# EasyEDA Pro project Custom Keyboard.epro, board PCB
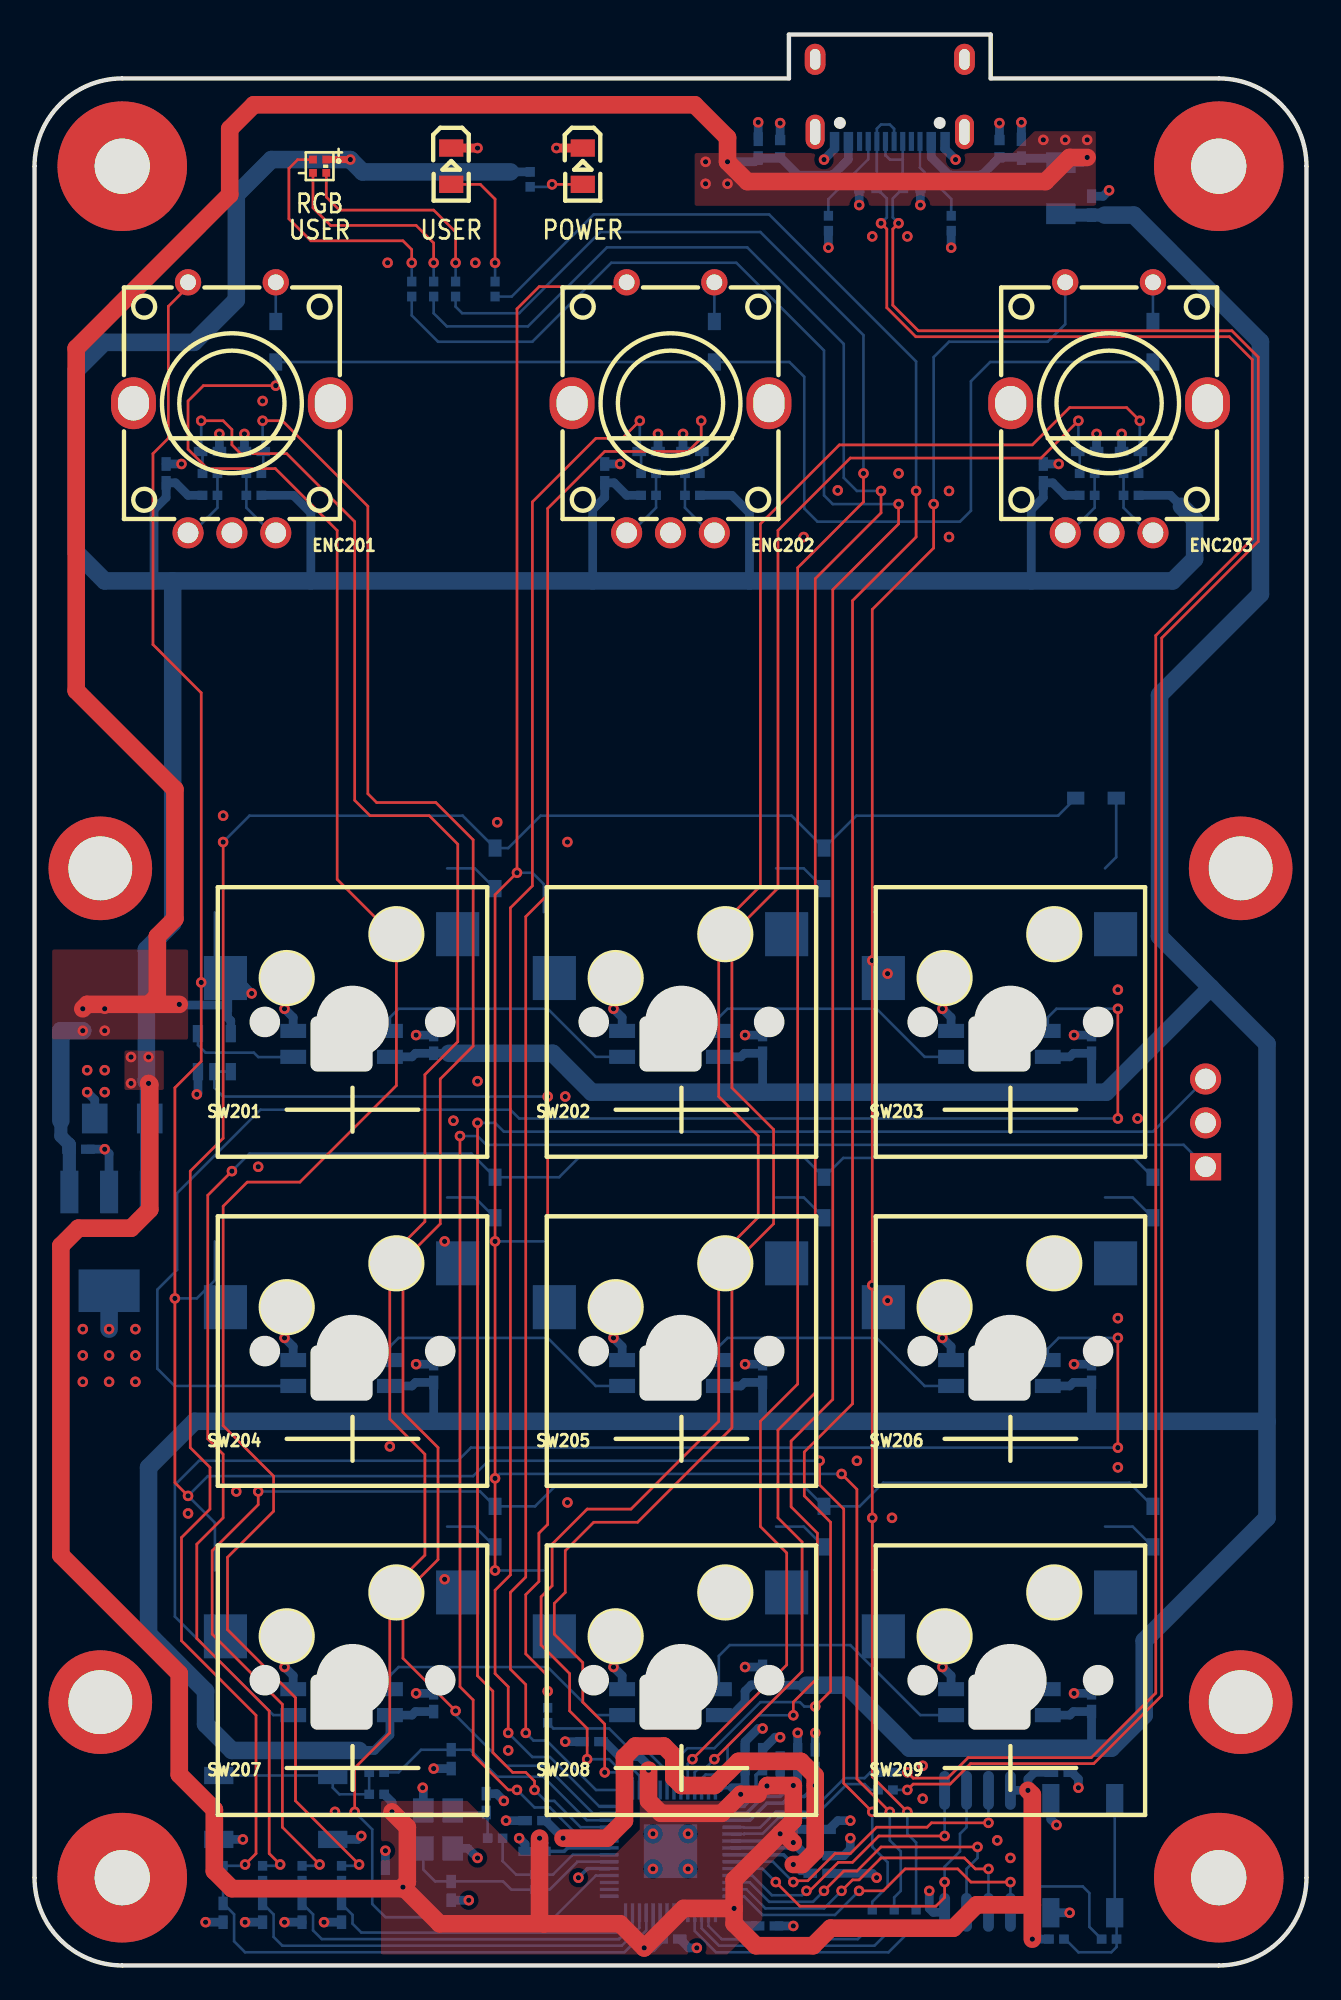
[diagram p2: board, top side]
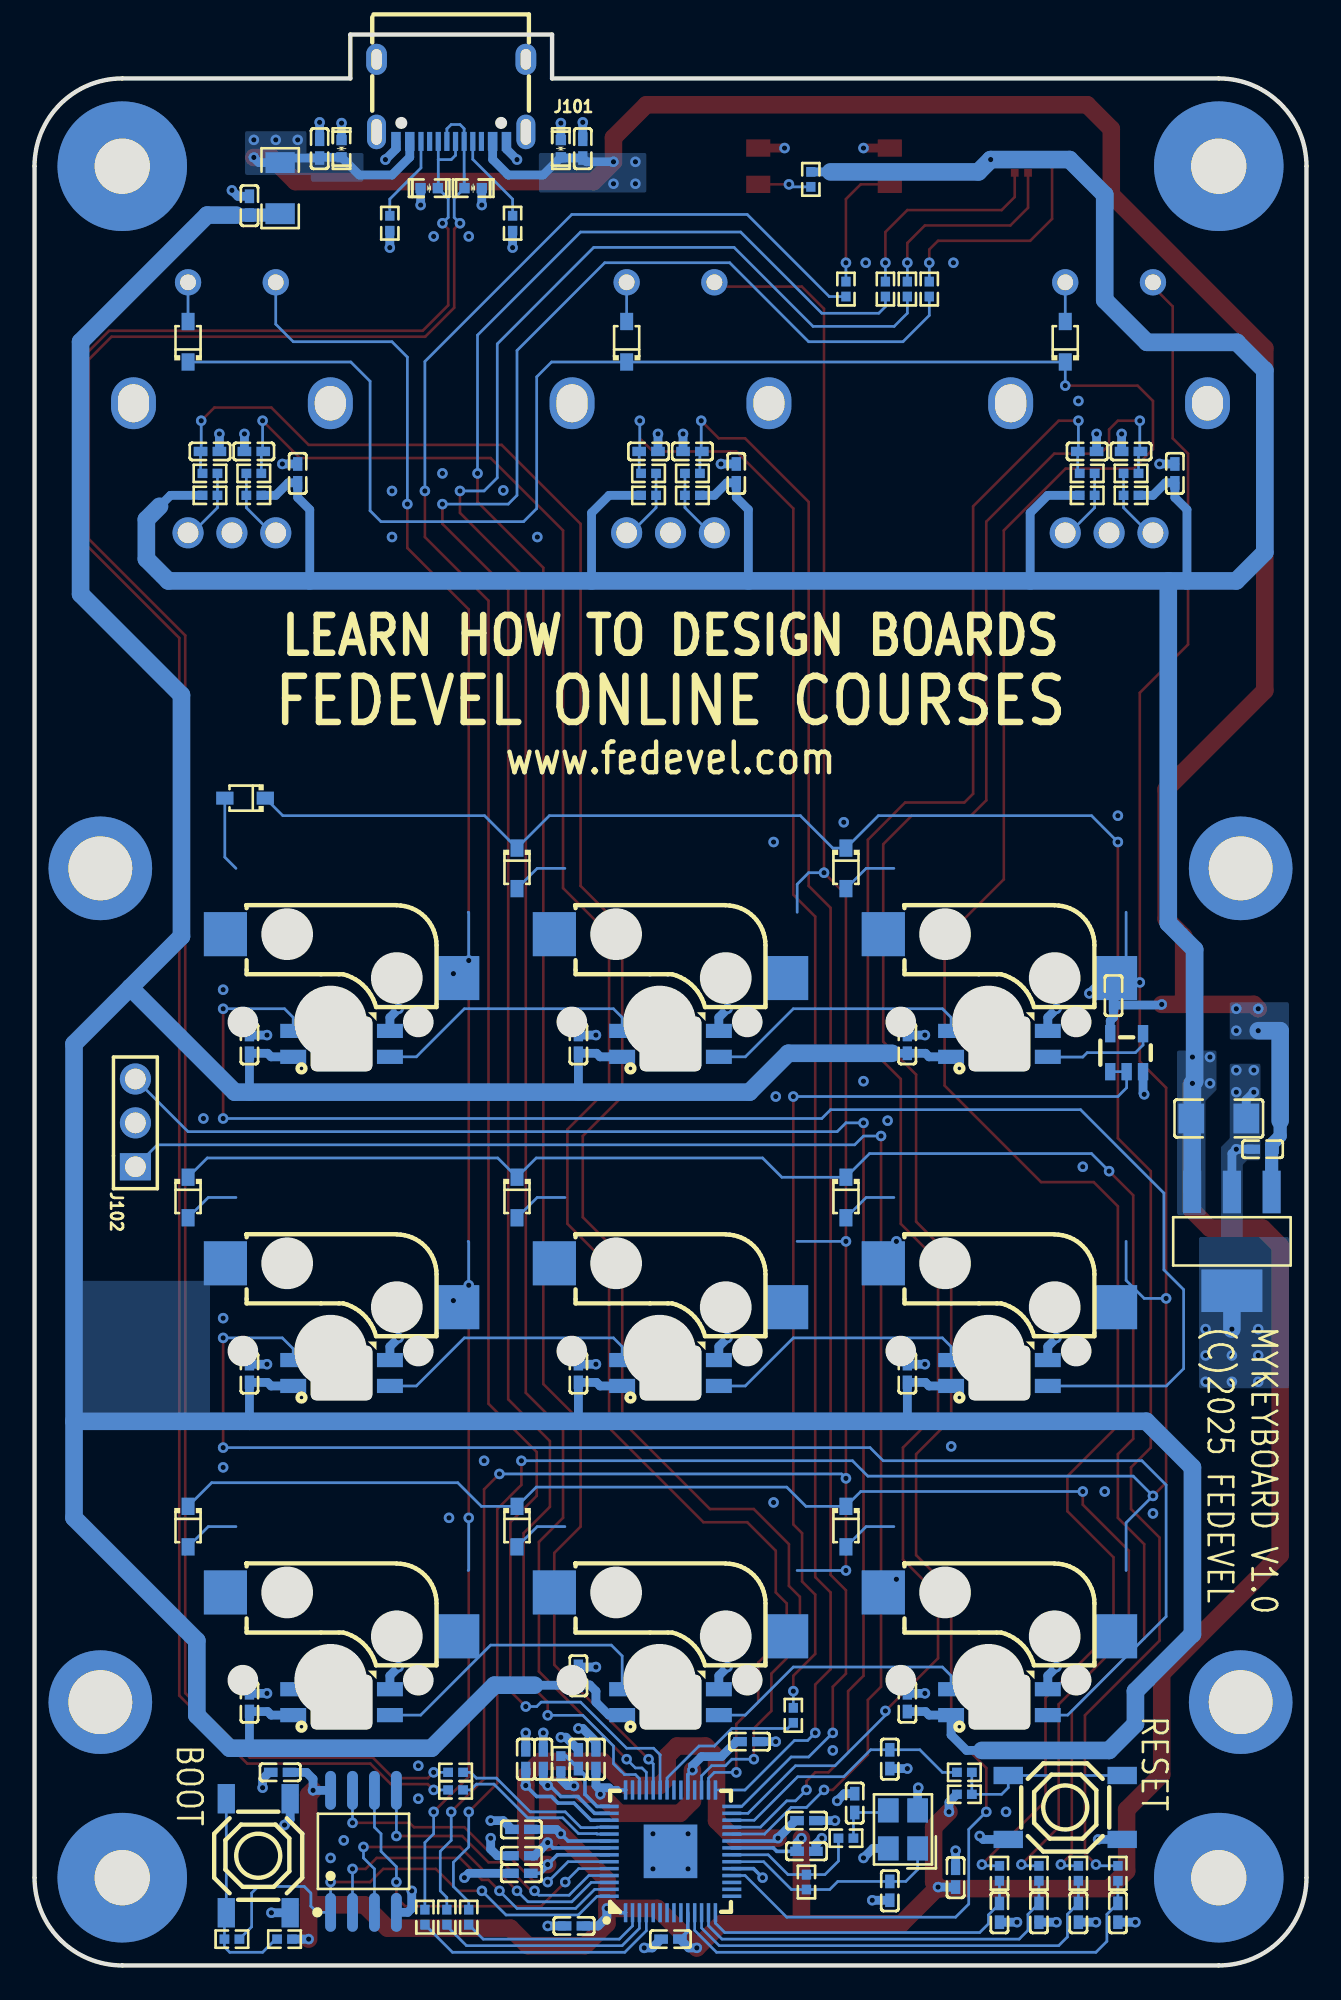
[diagram p3: board, bottom side, seen from below]

Outline 73.66 x 111.76 mm; copper layers: Top Layer, Inner1, Inner2, Bottom Layer. Coordinates in mm from the lower left corner of the outline.
Outline path: 0,104.14 0,5.08 arc(1.49,1.49) 5.08,0 68.58,0 arc(72.17,1.49) 73.66,5.08 73.66,104.14 arc(72.17,107.73) 68.58,109.22 55.37,109.22 55.37,111.76 43.69,111.76 43.69,109.22 5.08,109.22 arc(1.49,107.73) 0,104.14
Stack: Top Layer 0.035mm Outer layer copper thickness 1oz / Dielectric1 0.2104mm 7628 RC49% 8.6mil / Inner1 0.0152mm Inner layer copper thickness / Dielectric2 1.065mm 1.1mm H/HOZ Copper / Inner2 0.0152mm Inner layer copper thickness / Dielectric3 0.2104mm 7628 RC49% 8.6mil / Bottom Layer 0.035mm Outer layer copper thickness 1oz

## Design rules (mm)
net CON_USB_N: USB_CON
net CON_USB_P: USB_CON
net USB_N: USB
net USB_P: USB
template: User Custom Config
spacing copperThickness1oz (default): track to track 0.178, other pairs 0.076 to 0.305
spacing copperThickness2oz: track to track 0.203, other pairs 0.152 to 0.3
spacing copperThicknessInner0.5oz: track to track 0.089, other pairs 0.152 to 0.3
track width copperThickness1oz (default): min 0.152, default 0.203, max 2.54
track width copperThickness2oz: min 0.203, default 0.254, max 2.54
track width copperThickness0.5oz: min 0.089, default 0.254, max 2.54
differential pair differentialPair (default): width min 0.155, default 0.155, max 0.203; gap min 0.178, default 0.191
via viaSize (default): diameter min 0.61, default 0.61, max 10; hole min 0.305, default 0.305, max 6.299

## Placement (name value [footprint] x y rotation side)
C101  2.2uF  [C0402]  20.32 5.08 270 bottom
C102  100nF  [C0402]  45.47 7.87 180 bottom
C103  100nF  [C0402]  45.47 6.35 180 bottom
C104  100nF  [C0402]  41.15 11.94 270 bottom
C105  2.2uF  [C0402]  42.16 11.94 270 bottom
C106  2.2uF  [C0402]  44.2 11.94 270 bottom
C107  2.2uF  [C0402]  45.21 11.94 270 bottom
C108  100nF  [C0402]  45.47 5.33 180 bottom
C109  100nF  [C0402]  28.96 8.38 0 bottom
C110  1uF  [C0402]  61.21 101.85 270 bottom
C111  1uF  [C0402]  2.54 47.24 180 bottom
C112  47uF  [C1206]  5.08 49.02 0 bottom
C113  100nF  [C0402]  32.26 12.95 0 bottom
C114  100nF  [C0402]  28.96 6.6 0 bottom
C115  100nF  [C0402]  36.83 1.52 180 bottom
C116  100nF  [C0402]  42.42 2.29 180 bottom
C117  100nF  [C0402]  10.92 3.05 90 bottom
C118  1uF  [C0402]  41.91 105.16 270 bottom
C119  1uF  [C0402]  57.15 105.16 270 bottom
C120  100nF  [C0402]  13.21 3.05 90 bottom
C121  100nF  [C0402]  15.49 3.05 90 bottom
C122  100nF  [C0402]  17.78 3.05 90 bottom
C123  15pF  [C0402]  24.13 4.32 270 bottom
C124  15pF  [C0402]  26.16 9.4 90 bottom
C125  100nF  [C0402]  11.18 56.13 270 bottom
C126  100nF  [C0402]  59.44 11.18 180 bottom
C127  100nF  [C0402]  24.13 11.94 90 bottom
C201  2.2uF  [C0402]  7.62 86.36 270 bottom
C202  2.2uF  [C0402]  33.02 86.36 270 bottom
C203  10nF  [C0402]  10.16 87.63 180 bottom
C204  10nF  [C0402]  12.7 87.63 0 bottom
C205  10nF  [C0402]  35.56 87.63 180 bottom
C206  10nF  [C0402]  38.1 87.63 0 bottom
C207  2.2uF  [C0402]  58.42 86.36 270 bottom
C208  10nF  [C0402]  60.96 87.63 180 bottom
C209  10nF  [C0402]  63.5 87.63 0 bottom
C210  100nF  [C0402]  23.11 53.34 270 bottom
C211  100nF  [C0402]  42.16 53.34 270 bottom
C212  100nF  [C0402]  61.21 53.34 270 bottom
C213  100nF  [C0402]  23.11 34.29 270 bottom
C214  100nF  [C0402]  42.16 34.29 270 bottom
C215  100nF  [C0402]  61.21 34.29 270 bottom
C216  100nF  [C0402]  23.11 15.24 270 bottom
C217  100nF  [C0402]  42.16 16.76 270 bottom
C218  100nF  [C0402]  61.21 15.24 270 bottom
D101  GG0402052R542P  [D0402-BI]  43.18 105.16 270 bottom
D102  GG0402052R542P  [D0402-BI]  55.88 105.16 270 bottom
D103  GG0402052R542P  [D0402-BI]  48.26 102.87 0 bottom
D104  GG0402052R542P  [D0402-BI]  50.8 102.87 180 bottom
D201  1N5819WS  [SOD-323_L1.8-W1.3-LS2.5-RD]  26.67 63.5 270 bottom
D202  1N5819WS  [SOD-323_L1.8-W1.3-LS2.5-RD]  45.72 63.5 270 bottom
D203  1N5819WS  [SOD-323_L1.8-W1.3-LS2.5-RD]  61.47 67.56 0 bottom
D204  1N5819WS  [SOD-323_L1.8-W1.3-LS2.5-RD]  26.67 44.45 270 bottom
D205  1N5819WS  [SOD-323_L1.8-W1.3-LS2.5-RD]  45.72 44.45 270 bottom
D206  1N5819WS  [SOD-323_L1.8-W1.3-LS2.5-RD]  64.77 44.45 270 bottom
D207  1N5819WS  [SOD-323_L1.8-W1.3-LS2.5-RD]  26.67 25.4 270 bottom
D208  1N5819WS  [SOD-323_L1.8-W1.3-LS2.5-RD]  45.72 25.4 270 bottom
D209  1N5819WS  [SOD-323_L1.8-W1.3-LS2.5-RD]  64.77 25.4 270 bottom
D210  1N5819WS  [SOD-323_L1.8-W1.3-LS2.5-RD]  13.97 93.98 90 bottom
D211  1N5819WS  [SOD-323_L1.8-W1.3-LS2.5-RD]  39.37 93.98 90 bottom
D212  1N5819WS  [SOD-323_L1.8-W1.3-LS2.5-RD]  64.77 93.98 90 bottom
ENC201  PEC12R-4120F-S0012  [SW-TH_PEC12R-4120F-S0012_1]  11.43 90.17 0 top
ENC202  PEC12R-4120F-S0012  [SW-TH_PEC12R-4120F-S0012_1]  36.83 90.17 0 top
ENC203  PEC12R-4120F-S0012  [SW-TH_PEC12R-4120F-S0012_1]  62.23 90.17 0 top
J101  TYPE-C 16PIN 2MD(073)  [USB-C-SMD_TYPE-C-6PIN-2MD-073]  49.53 107.95 0 bottom
J102  2.54-1*3P针  [HDR-TH_3P-P2.54-V-M-1]  67.82 48.77 90 bottom
J201  CPG151101S11-16  [SMD_KEYBOARD-SW_1]  17.78 58.42 0 bottom
J202  CPG151101S11-16  [SMD_KEYBOARD-SW_1]  36.83 58.42 0 bottom
J203  CPG151101S11-16  [SMD_KEYBOARD-SW_1]  55.88 58.42 0 bottom
J204  CPG151101S11-16  [SMD_KEYBOARD-SW_1]  17.78 39.37 0 bottom
J205  CPG151101S11-16  [SMD_KEYBOARD-SW_1]  36.83 39.37 0 bottom
J206  CPG151101S11-16  [SMD_KEYBOARD-SW_1]  55.88 39.37 0 bottom
J207  CPG151101S11-16  [SMD_KEYBOARD-SW_1]  17.78 20.32 0 bottom
J208  CPG151101S11-16  [SMD_KEYBOARD-SW_1]  36.83 20.32 0 bottom
J209  CPG151101S11-16  [SMD_KEYBOARD-SW_1]  55.88 20.32 0 bottom
LED101  NH-B1010RGBT-HF  [LED-ARRAY-SMD_4P-L1.0-W1.0-TR_NH-B1010RGBT_1]  16.51 104.14 0 top
LED102  KT-0805G  [LED0805-R-RD]  31.75 104.14 270 top
LED103  KT-0805Y  [LED0805-R-RD]  24.13 104.14 270 top
LED201  SK6812MINI-E  [LED-SMD_L3.2-W2.8-TR]  17.78 53.34 0 bottom
LED202  SK6812MINI-E  [LED-SMD_L3.2-W2.8-TR]  36.83 53.34 0 bottom
LED203  SK6812MINI-E  [LED-SMD_L3.2-W2.8-TR]  55.88 53.34 0 bottom
LED204  SK6812MINI-E  [LED-SMD_L3.2-W2.8-TR]  17.78 34.29 0 bottom
LED205  SK6812MINI-E  [LED-SMD_L3.2-W2.8-TR]  36.83 34.29 0 bottom
LED206  SK6812MINI-E  [LED-SMD_L3.2-W2.8-TR]  55.88 34.29 0 bottom
LED207  SK6812MINI-E  [LED-SMD_L3.2-W2.8-TR]  17.78 15.24 0 bottom
LED208  SK6812MINI-E  [LED-SMD_L3.2-W2.8-TR]  36.83 15.24 0 bottom
LED209  SK6812MINI-E  [LED-SMD_L3.2-W2.8-TR]  55.88 15.24 0 bottom
MH201  STANDOFF_M2.5x3.5MM  [STANDOFF_M2.5x3.5MM_RF_v1.0]  3.81 15.24 0 top
MH202  STANDOFF_M2.5x3.5MM  [STANDOFF_M2.5x3.5MM_RF_v1.0]  69.85 15.24 0 top
MH203  STANDOFF_M2.5x3.5MM  [STANDOFF_M2.5x3.5MM_RF_v1.0]  3.81 63.5 0 top
MH204  STANDOFF_M2.5x3.5MM  [STANDOFF_M2.5x3.5MM_RF_v1.0]  69.85 63.5 0 top
MH205  -  [MH_7.5X3.2MM_RF_v1.0]  5.08 5.08 0 top
MH206  -  [MH_7.5X3.2MM_RF_v1.0]  68.58 5.08 0 top
MH207  -  [MH_7.5X3.2MM_RF_v1.0]  5.08 104.14 0 top
MH208  -  [MH_7.5X3.2MM_RF_v1.0]  68.58 104.14 0 top
R101  200Ω  [R0402]  43.18 11.68 90 bottom
R102  100mΩ  [R1206]  59.44 102.87 270 bottom
R103  1kΩ  [R0402]  26.67 97.03 270 bottom
R104  1kΩ  [R0402]  28.7 103.38 90 bottom
R105  1kΩ  [R0402]  24.38 97.03 270 bottom
R106  1kΩ  [R0402]  23.11 97.03 270 bottom
R107  1kΩ  [R0402]  21.84 97.03 270 bottom
R108  27Ω  [R0402]  48.51 2.79 90 bottom
R109  27Ω  [R0402]  49.28 11.18 180 bottom
R110  27Ω  [R0402]  49.78 2.79 90 bottom
R111  27Ω  [R0402]  49.28 10.16 180 bottom
R112  27Ω  [R0402]  51.05 2.79 90 bottom
R113  0Ω  [R0402]  10.92 5.33 90 bottom
R114  0Ω  [R0402]  13.21 5.33 90 bottom
R115  0Ω  [R0402]  15.49 5.33 90 bottom
R116  0Ω  [R0402]  17.78 5.33 90 bottom
R117  27Ω  [R0402]  29.72 14.48 90 bottom
R118  5.1kΩ  [R0402]  53.09 100.84 90 bottom
R119  5.1kΩ  [R0402]  45.97 100.84 90 bottom
R120  1MΩ  [R0402]  28.96 4.83 270 bottom
R121  1kΩ  [R0402]  26.67 7.37 0 bottom
R122  100kΩ  [R0402]  59.18 1.52 180 bottom
R123  10kΩ  [R0402]  19.81 9.91 0 bottom
R124  1kΩ  [R0402]  62.23 1.52 180 bottom
R125  27Ω  [R0402]  19.81 11.18 0 bottom
R201  10kΩ  [R0402]  10.16 85.09 180 bottom
R202  10kΩ  [R0402]  12.7 85.09 0 bottom
R203  10kΩ  [R0402]  35.56 85.09 180 bottom
R204  10kΩ  [R0402]  38.1 85.09 0 bottom
R205  10kΩ  [R0402]  10.16 86.36 0 bottom
R206  10kΩ  [R0402]  35.56 86.36 0 bottom
R207  10kΩ  [R0402]  12.7 86.36 180 bottom
R208  10kΩ  [R0402]  38.1 86.36 180 bottom
R209  10kΩ  [R0402]  60.96 85.09 180 bottom
R210  10kΩ  [R0402]  63.5 85.09 0 bottom
R211  10kΩ  [R0402]  60.96 86.36 0 bottom
R212  10kΩ  [R0402]  63.5 86.36 180 bottom
SW101  TS-1187A-B-A-B  [SW-SMD_4P-L5.1-W5.1-P3.70-LS6.5-TL-2]  60.71 6.35 270 bottom
SW102  TS-1187A-B-A-B  [SW-SMD_4P-L5.1-W5.1-P3.70-LS6.5-TL-2]  13.97 9.14 0 bottom
SW201  CPG151101S21  [KEY-TH_CPG1511F01S0X_1]  17.78 58.42 0 top
SW202  CPG151101S21  [KEY-TH_CPG1511F01S0X_1]  36.83 58.42 0 top
SW203  CPG151101S21  [KEY-TH_CPG1511F01S0X_1]  55.88 58.42 0 top
SW204  CPG151101S21  [KEY-TH_CPG1511F01S0X_1]  17.78 39.37 0 top
SW205  CPG151101S21  [KEY-TH_CPG1511F01S0X_1]  36.83 39.37 0 top
SW206  CPG151101S21  [KEY-TH_CPG1511F01S0X_1]  55.88 39.37 0 top
SW207  CPG151101S21  [KEY-TH_CPG1511F01S0X_1]  17.78 20.32 0 top
SW208  CPG151101S21  [KEY-TH_CPG1511F01S0X_1]  36.83 20.32 0 top
SW209  CPG151101S21  [KEY-TH_CPG1511F01S0X_1]  55.88 20.32 0 top
U101  RP2040  [LQFN-56_L7.0-W7.0-P0.4-EP_1]  36.83 6.6 90 bottom
U102  LM3940IMP-3.3/NOPB  [SOT-223_L6.5-W3.5-P2.30-LS7.0-BR]  4.32 41.91 90 bottom
U103  SN74LV1T34DBVR  [SOT-23-5_L2.9-W1.6-P0.95-LS2.8-BR]  10.41 52.83 270 bottom
U104  W25Q128JVSIQ  [SOIC-8_L5.3-W5.3-P1.27-LS8.0-BL]  54.61 6.6 180 bottom
Y101  ABM8-272-T3  [CRYSTAL-SMD_4P-L3.2-W2.5-BL]  23.37 7.87 90 bottom

## Footprints (pads in the part's own frame, mm; a bottom-side part is the same pattern mirrored in y, then rotated)
C0402
  rect 0.79x0.54 smd: 1(-0.545,0) 2(0.545,0)
C1206
  rect 1.485x1.728 smd: 1(-1.593,0) 2(1.593,0)
CRYSTAL-SMD_4P-L3.2-W2.5-BL
  rect 1.4x1.2 smd: 1(-1.1,-0.85) 2(1.1,-0.85) 3(1.1,0.85) 4(-1.1,0.85)
D0402-BI
  rect 0.6x0.6 smd: 1(-0.5,0) 2(0.5,0)
HDR-TH_3P-P2.54-V-M-1
  rect 1.575x1.8 hole 1.2: 1(-2.54,0)
  round 1.8 hole 1.2: 2(0,0) 3(2.54,0)
LED0805-R-RD
  rect 1x1.399 smd: 1(1.05,0) 2(-1.05,0)
LED-ARRAY-SMD_4P-L1.0-W1.0-TR_NH-B1010RGBT_1
  rect 0.45x0.45 smd: 1(0.385,0.385) 2(0.385,-0.385) 3(-0.385,-0.385) 4(-0.385,0.385)
LED-SMD_L3.2-W2.8-TR
  rect 1.5x0.82 smd: 1(2.8,0.75) 2(2.8,-0.75) 3(-2.8,-0.75) 4(-2.8,0.75)
LQFN-56_L7.0-W7.0-P0.4-EP_1
  rect 1.1x0.2 smd: 1(-3.55,2.6) 2(-3.55,2.2) 3(-3.55,1.8) 4(-3.55,1.4) 5(-3.55,1) 6(-3.55,0.6) 7(-3.55,0.2) 8(-3.55,-0.2) 9(-3.55,-0.6) 10(-3.55,-1) 11(-3.55,-1.4) 12(-3.55,-1.8) 13(-3.55,-2.2) 14(-3.55,-2.6) 29(3.55,-2.6) 30(3.55,-2.2) 31(3.55,-1.8) 32(3.55,-1.4) 33(3.55,-1) 34(3.55,-0.6) 35(3.55,-0.2) 36(3.55,0.2) 37(3.55,0.6) 38(3.55,1) 39(3.55,1.4) 40(3.55,1.8) 41(3.55,2.2) 42(3.55,2.6)
  rect 0.2x1.1 smd: 15(-2.6,-3.55) 16(-2.2,-3.55) 17(-1.8,-3.55) 18(-1.4,-3.55) 19(-1,-3.55) 20(-0.6,-3.55) 21(-0.2,-3.55) 22(0.2,-3.55) 23(0.6,-3.55) 24(1,-3.55) 25(1.4,-3.55) 26(1.8,-3.55) 27(2.2,-3.55) 28(2.6,-3.55) 43(2.6,3.55) 44(2.2,3.55) 45(1.8,3.55) 46(1.4,3.55) 47(1,3.55) 48(0.6,3.55) 49(0.2,3.55) 50(-0.2,3.55) 51(-0.6,3.55) 52(-1,3.55) 53(-1.4,3.55) 54(-1.8,3.55) 55(-2.2,3.55) 56(-2.6,3.55)
  rect 3.1x3.1 smd: 57(0,0)
MH_7.5X3.2MM_RF_v1.0
  round 7.5 hole 3.2: 1(0,0)
R0402
  rect 0.566x0.54 smd: 1(-0.433,0) 2(0.433,0)
R1206
  rect 1.208x1.701 smd: 1(-1.479,0) 2(1.479,0)
SMD_KEYBOARD-SW_1
  rect 2.5x2.55 smd: 1(-6.725,1.27) 2(6.725,-1.27)
SOD-323_L1.8-W1.3-LS2.5-RD
  rect 1x0.75 smd: 1(-1.173,0) 2(1.173,0)
SOIC-8_L5.3-W5.3-P1.27-LS8.0-BL
  oval 0.63x2.25 smd: 1(-1.905,-3.53) 2(-0.635,-3.53) 3(0.635,-3.53) 4(1.905,-3.53) 5(1.905,3.53) 6(0.635,3.53) 7(-0.635,3.53) 8(-1.905,3.53)
SOT-23-5_L2.9-W1.6-P0.95-LS2.8-BR
  rect 1x0.6 smd: 1(1.1,-0.95) 2(1.1,0) 3(1.1,0.95) 4(-1.1,0.95) 5(-1.1,-0.95)
SOT-223_L6.5-W3.5-P2.30-LS7.0-BR
  rect 2.465x1.05 smd: 1(2.857,-2.3) 2(2.857,0) 3(2.857,2.3)
  rect 2.465x3.54 smd: 4(-2.857,0)
STANDOFF_M2.5x3.5MM_RF_v1.0
  round 6 hole 3.7: 1(0,0)
SW-SMD_4P-L5.1-W5.1-P3.70-LS6.5-TL-2
  rect 1.7x1 smd: 1(-3.3,1.85) 2(3.3,1.85) 3(-3.3,-1.85) 4(3.3,-1.85)
SW-TH_PEC12R-4120F-S0012_1
  round 1.524 hole 0.914: 1(-2.54,7.25) 2(2.54,7.25)
  oval 2.6x3 hole 1.8x2.2: 3(5.7,0.25)
  oval 2.6x3 hole 1.8x2: 4(-5.7,0.25)
  round 1.8 hole 1.2: A(-2.54,-7.25) B(2.54,-7.25) C(0,-7.25)
USB-C-SMD_TYPE-C-6PIN-2MD-073
  rect 0.55x1.1 smd: 1(-3.2,2.375) 2(-2.4,2.375) 11(2.4,2.375) 12(3.2,2.375)
  rect 0.3x1.1 smd: 3(-1.75,2.375) 4(-1.25,2.375) 5(-0.75,2.375) 6(-0.25,2.375) 7(0.25,2.375) 8(0.75,2.375) 9(1.25,2.375) 10(1.75,2.375)
  oval 1.2x1.8 hole 0.6x1.2: 13(-4.325,-2.375) 14(4.325,-2.375)
  oval 1.1x2 hole 0.6x1.5: 13(-4.325,1.825) 14(4.325,1.825)

## Nets
As in the schematic.

Pads without a net: J101 3 9; LED209 2; U101 5 6 7 8 9 15 16 17 32 34 35 41

## Via types
v1: diameter 0.61, hole 0.305, Top Layer to Bottom Layer, 235 vias

## Routing (per net, layer and track width the routed paths; a pad name or vN(x,y) marks a point on that pad's centre or on a via; arc(x,y) is an arc through that point)
+1V1: length 43.5
  Top Layer w1.016: v1(43.94,5.84) 44.45,5.84 45.21,6.6 v1(45.21,10.41) 45.21,10.98 44.38,11.81 40.77,11.81 39.37,10.41 37.47,10.41 37.02,10.86 37.02,12.13 36.45,12.7 34.8,12.7 34.16,12.06 34.16,8.38 33.15,7.37 v1(30.61,7.37)
  Bottom Layer w0.205: U101.45 41.42,8.4 42.42,9.4 43.34,9.4 43.72,9.78 44.58,9.78 v1(45.21,10.41) ; U101.23 30.77,7.2 v1(30.61,7.37) ; 44.92,5.33 44.32,5.33 43.94,5.72 v1(43.94,5.84) 43.38,6.4 U101.50
  Bottom Layer w0.508: v1(30.61,7.37) 29.59,8.38 C109.2 ; C107.2 v1(45.21,10.41)
+3V3: length 381.1
  Top Layer w0.406: LED101.1 v1(18.29,104.53)
  Top Layer w1.016: 29.5,2.41 23.46,2.41 v1(21.34,4.53) ; 29.5,2.41 29.25,2.67 v1(29.25,7.37) ; 29.5,2.41 33.91,2.41 v1(35.31,1.02) 37.59,3.3 v1(40.51,3.3) ; 57.78,3.51 57.78,9.88 v1(57.53,10.13) ; 57.78,3.51 v1(57.78,1.52) ; 57.78,3.51 54.56,3.51 53.21,2.16 46.1,2.16 45.09,1.14 41.78,1.14 40.51,2.41 v1(40.51,3.3) ; v1(40.51,3.3) 40.51,4.95 v1(43.18,7.62) ; v1(43.94,7.11) 43.43,7.62 v1(43.18,7.62) ; v1(20.7,8.89) 21.59,8 21.59,4.83 21.21,4.44 11.43,4.44 10.41,5.46 10.41,9.02 8.38,11.05 8.38,16.89 1.52,23.75 1.52,41.66 2.54,42.67 5.59,42.67 6.67,43.76 6.67,50.99 v1(6.6,51.05) ; 41.91,9.91 v1(40.89,9.91) 39.79,8.81 36.28,8.81 35.56,9.53 v1(35.56,11.3) ; v1(42.42,10.39) 42.44,10.41 v1(43.94,10.41) 43.94,8.38 v1(43.18,7.62)
  Bottom Layer w0.205: v1(43.94,10.41) 43.81,10.41 43.18,9.78 42.2,9.78 41.22,8.8 U101.44 ; v1(40.51,3.3) 40,3.3 39.76,3.05 U101.1 ; U101.42 39.75,10.15 39.88,10.29 40.39,10.29 ; C114.2 30.67,6.6 30.87,6.8 U101.22 ; U101.49 43.63,6.8 v1(43.94,7.11) ; U101.33 35.83,11.03 v1(35.56,11.3) ; v1(43.18,7.62) 42.76,7.2 U101.48 ; U101.10 35.83,1.98 36.28,1.52
  Bottom Layer w0.508: 41.4,80.14 41.4,84.07 40.39,85.09 R204.2 ; v1(35.56,11.3) 35.56,11.56 35.03,12.09 33.88,12.09 33.01,12.95 C113.2 ; R210.2 65.79,85.09 66.42,84.45 ; R101.1 43.18,10.79 42.8,10.41 42.42,10.41 ; 13.13,85.09 14.99,85.09 16,84.07 16,80.14 ; R122.2 v1(57.78,1.52) ; R203.2 34.29,85.09 33.56,85.81 C202.2 33.02,84.96 32.32,84.26 32.32,80.14 ; v1(20.7,8.89) 20.7,9.45 R123.2 ; 41.02,10.29 40.89,10.16 v1(40.89,9.91) ; 41.02,10.29 40.39,10.29 ; 41.02,10.29 41.15,10.41 C104.2 ; C106.2 44.2,10.67 v1(43.94,10.41) ; C101.2 v1(21.34,4.53) ; v1(43.94,7.11) 44.7,6.35 44.92,6.35 ; C126.2 57.91,11.18 57.53,10.79 v1(57.53,10.13) U104.8 ; C114.2 29.5,7.11 v1(29.25,7.37) ; 41.87,2.29 41.02,2.29 40.51,2.79 v1(40.51,3.3) ; R104.2 27.56,103.81 ; 57.72,80.14 57.72,84.26 58.42,84.96 C207.2 58.97,85.81 59.69,85.09 R209.2 ; 36.28,1.52 35.78,1.02 v1(35.31,1.02) ; v1(43.18,7.62) 43.43,7.87 44.92,7.87 ; 9.73,85.09 8.89,85.09 8.17,85.81 C201.2 7.62,84.96 6.92,84.26 6.92,80.14
  Bottom Layer w1.016: 66.42,84.45 67.18,83.69 67.18,81.41 65.91,80.14 8,80.14 ; 18.29,104.52 19,103.81 27.56,103.81 ; 8,80.14 8,60.33 6.48,58.8 6.48,51.18 v1(6.6,51.05) 6.6,49.09 C112.2 6.62,48.97 U102.3 ; 8,80.14 4.06,80.14 2.41,81.79 2.41,92.33 4.03,93.95 9.24,93.95 11.68,96.39 11.68,102.49 13.72,104.53 v1(18.29,104.53)
  vias: v1(5.59,52.58) v1(5.59,51.05) v1(6.6,52.58)
+3V3_A: length 4.7
  Bottom Layer w0.205: U101.43 41.08,9.2 41.78,9.91 41.78,11.01 C105.2 42.89,12.12 R101.2
+5V_LEDS: length 307.7
  Bottom Layer w0.508: LED209.1 59.96,14.49 60.16,14.69 C218.2 61.21,12.57 ; 42.16,31.5 C214.2 41.11,33.75 40.91,33.54 LED205.1 ; LED201.1 21.86,52.59 22.06,52.8 C210.2 24,52.8 ; 44.7,16.22 C217.2 42.15,16.23 41.51,16.23 41.15,15.88 41.15,15.24 40.4,14.49 LED208.1 ; 61.21,31.5 C215.2 60.16,33.75 59.96,33.54 LED206.1 ; LED202.1 40.91,52.59 41.11,52.8 C211.2 42.16,50.55 ; LED204.1 21.86,33.54 22.06,33.75 C213.2 23.11,31.5 ; LED203.1 59.96,52.59 60.16,52.8 C212.2 61.21,50.55 ; C216.2 22.06,14.69 21.86,14.49 LED207.1 20.58,13.34 19.69,12.45 18.92,12.45
  Bottom Layer w0.762: 61.98,101.31 C110.2 59.52,101.31 R102.2
  Bottom Layer w1.016: 44.7,16.22 47.03,16.22 50.67,12.57 62.36,12.57 64.26,14.48 64.26,18.8 71.37,25.91 71.37,31.5 ; 71.37,31.5 9.27,31.5 6.6,28.83 6.6,19.18 9.91,15.88 9.91,13.97 11.43,12.45 18.8,12.45 ; 71.37,31.5 71.37,53.34 68.12,56.6 ; 68.12,56.6 62.06,50.55 32.26,50.55 30.01,52.8 24,52.8 ; 68.12,56.6 65.15,59.56 65.15,73.53 70.99,79.38 70.99,93.98 63.66,101.31 61.98,101.31
+5V_USB: length 151.9
  Top Layer w1.016: 6.62,55.63 7.11,56.12 7.11,59.56 8.13,60.58 8.13,68.07 2.41,73.79 2.41,93.6 11.3,102.49 11.3,106.3 12.7,107.7 38.23,107.7 40.13,105.79 v1(40.13,104.39) 41.28,103.25 58.55,103.25 59.94,104.65 v1(60.96,104.65) ; 6.62,55.63 3.05,55.63 v1(2.79,55.37) ; 6.62,55.63 v1(8.38,55.63)
  Bottom Layer w0.508: v1(8.38,55.63) 8.42,55.59 C125.2 11.18,54.87 11.36,54.68 U103.5 ; v1(60.96,104.65) 60.66,104.35 R102.1 59.17,104.61 C119.2 57.1,104.66 D102.2 54.86,103.63 52.96,103.63 51.93,104.66 J101.11 ; J101.2 47.13,104.53 46.23,103.63 44.2,103.63 D101.2 43.13,104.61 C118.2 41.69,104.39 v1(40.13,104.39)
  Bottom Layer w0.762: 2.02,47.51 2,47.53 ; 2,47.53 C111.2 ; 2,47.53 1.52,48.01 1.52,48.89 ; U102.1 2.02,47.22
  Bottom Layer w1.016: 1.52,48.89 1.52,54.1 v1(2.79,54.1)
  vias: v1(4.06,55.37) v1(4.06,54.1) v1(38.86,104.39) v1(38.86,103.12) v1(40.13,103.12) v1(58.42,105.66) v1(59.69,105.66) v1(60.96,105.66)
GND: length 95.4
  Top Layer w0.508: LED103.2 v1(25.65,105.19) ; LED102.2 v1(30.23,105.19)
  Bottom Layer w0.205: v1(31.5,5.08) 32.02,5.6 U101.19
  Bottom Layer w0.508: v1(33.53,17.27) 34.03,16.77 LED208.3 ; v1(47.24,7.37) 47.24,6.73 46.86,6.35 C103.1 ; D103.1 v1(47.76,101.89) ; C110.1 61.89,102.4 v1(62.23,102.74) ; LED206.3 53.08,35.82 v1(52.58,36.32) ; U104.4 52.04,3.07 51.82,3.3 v1(51.82,4.32) ; C109.1 v1(27.31,8.38) ; v1(12.57,56.26) 12.16,56.68 C125.1 ; 24.13,3.77 v1(25.15,3.77) ; v1(28.07,7.37) 28.41,7.02 C114.1 ; J101.12 52.73,105.13 v1(53.34,104.52) ; v1(14.48,36.32) 14.98,35.82 LED204.3 ; SW101.1 58.86,8.45 v1(59.18,8.13) ; C119.1 v1(57.15,106.68) ; C213.1 23.08,34.8 v1(22.1,34.8) ; 26.16,9.94 26.76,9.94 v1(27.18,9.53) ; v1(60.45,10.29) 60.45,10.79 60.07,11.18 C126.1 ; C210.1 23.08,53.85 v1(22.1,53.85) ; C101.1 v1(20.32,6.64) ; Y101.4 25.1,6.77 v1(25.65,6.22) ; C201.1 v1(8.51,86.91) ; C217.1 42.13,17.27 v1(41.15,17.27) ; U102.2 4.32,46.99 v1(4.06,47.24) 3.08,47.24 ; v1(3.05,50.55) 3.49,50.11 C112.1 ; C117.1 v1(9.91,2.5) ; D102.1 v1(55.88,106.63) ; U103.3 9.46,50.48 v1(9.4,50.42) ; LED205.3 34.03,35.82 v1(33.53,36.32) ; LED209.3 53.08,16.77 v1(52.58,17.27) ; C127.1 v1(23.11,11.39) ; 44.2,12.48 v1(44.2,13.46) ; R118.1 v1(53.09,99.43) ; v1(60.2,15.75) 61.18,15.75 C218.1 ; 45.21,12.48 v1(45.21,13.46) ; J101.1 46.33,105.13 v1(45.72,104.52) ; C206.1 v1(37.56,88.65) ; C118.1 v1(41.91,106.68) ; LED207.3 14.98,16.77 v1(14.48,17.27) ; C215.1 61.18,34.8 v1(60.2,34.8) ; v1(48.77,5.08) 48.51,5.33 C108.1 ; D104.1 v1(51.3,101.89) ; 31.71,12.95 v1(30.73,12.95) ; C204.1 v1(12.16,88.65) ; v1(52.58,55.37) 53.08,54.87 LED203.3 ; C121.1 v1(14.48,2.5) ; C122.1 v1(16.76,2.5) ; D101.1 v1(43.18,106.63) ; v1(41.15,34.8) 42.13,34.8 C214.1 ; C120.1 v1(12.19,2.5) ; 41.15,12.48 41.15,12.95 41.91,13.72 v1(42.16,13.72) ; SW102.1 v1(12.06,7.29) ; C102.1 46.52,8.38 v1(47.24,8.38) ; v1(33.53,55.37) 34.03,54.87 LED202.3 ; C209.1 v1(62.96,88.65) ; C211.1 42.13,53.85 v1(41.15,53.85) ; v1(60.2,53.85) 61.18,53.85 C212.1 ; C202.1 v1(33.91,86.91) ; C216.1 23.08,15.75 v1(22.1,15.75) ; C203.1 v1(10.7,88.65) ; v1(38.35,1.02) 37.88,1.02 C115.1 ; C207.1 v1(59.31,86.91) ; C205.1 v1(36.1,88.65) ; v1(14.48,55.37) 14.98,54.87 LED201.3 ; C116.1 v1(43.94,2.29) ; SW101.2 v1(59.94,3.05) ; SW102.2 18.72,7.29 v1(18.92,7.49) ; R119.1 v1(45.97,99.43) ; v1(43.18,13.21) 42.89,13.21 42.16,12.48 ; C208.1 v1(61.5,88.65) ; v1(22.48,10.29) 22.52,10.25 Y101.2
  Bottom Layer w1.016: U102.4 v1(4.32,36.83)
  vias: v1(2.79,36.83) v1(2.79,35.31) v1(2.79,33.78) v1(3.05,51.82) v1(4.06,51.82) v1(4.06,50.55) v1(4.32,35.31) v1(4.32,33.78) v1(5.84,36.83) v1(5.84,35.31) v1(5.84,33.78) v1(8.89,26.16) v1(10.92,66.55) v1(11.68,27.43) v1(12.95,46.23) v1(13.21,90.55) v1(17.4,8.89) v1(20.45,98.55) v1(20.57,30.04) v1(23.75,41.91) v1(23.75,22.35) v1(24.26,48.89) v1(25.53,98.55) v1(25.65,51.18) v1(26.8,66.17) v1(27.43,12.45) v1(30.73,50.29) v1(30.86,65.02) v1(30.86,26.8) v1(35.81,7.62) v1(35.81,5.59) v1(37.85,7.62) v1(37.85,5.59) v1(44.54,82.68) v1(46.51,85.38) v1(47.62,29.21) v1(48.51,100.08) v1(49.4,57.4) v1(49.4,38.48) v1(49.66,25.91) v1(50.04,86.36) v1(50.55,100.08) v1(51.44,11.56) v1(51.44,9.65) v1(52.96,85.34) v1(52.96,82.68) v1(55.75,7.24) v1(56.51,6.22) v1(62.74,56.48) v1(62.74,37.47) v1(62.74,28.83) v1(63.88,49.02)
COL0: length 152.6
  Top Layer w0.152: v1(48.51,8.89) 46.86,10.54 46.86,26.42 45.47,27.81 v1(45.47,29.21) ; 8.89,97.17 7.75,96.03 7.75,88.39 6.86,87.5 6.86,76.45 9.65,73.66 v1(9.65,56.9) 9.65,52.32 8.13,50.8 v1(8.13,38.61) 8.13,27.94 v1(8.89,27.18)
  Bottom Layer w0.152: 10.45,22.86 10.45,25.62 v1(8.89,27.18) 10.03,28.32 25.4,28.32 26.29,29.21 v1(45.47,29.21) ; R108.2 48.51,3.68 49.4,4.57 49.4,5.97 48.51,6.86 v1(48.51,8.89) ; 8.25,38.61 9.4,38.61 10.45,39.66 10.45,41.91 ; v1(9.65,56.9) 10.45,57.69 10.45,60.96
COL0_R: length 10.9
  Bottom Layer w0.152: U101.2 39.03,2.29 39.79,1.52 47.68,1.52 48.51,2.36
COL1: length 136.5
  Top Layer w0.152: v1(46.74,28.45) 47.62,27.56 47.62,10.79 v1(49.53,8.89) ; 34.29,97.17 29.23,97.17 27.94,95.89 v1(27.94,63.25) 26.67,61.98 v1(26.67,41.91) v1(26.67,28.19) v1(26.67,22.86)
  Bottom Layer w0.152: v1(26.67,28.19) 26.92,28.45 v1(46.74,28.45) ; 29.5,22.86 v1(26.67,22.86) ; 29.5,60.96 29.5,62.58 28.83,63.25 v1(27.94,63.25) ; R110.2 49.78,3.94 50.16,4.32 50.16,6.6 49.53,7.24 v1(49.53,8.89) ; 29.5,41.91 v1(26.67,41.91)
COL1_R: length 13
  Bottom Layer w0.152: U101.3 38.63,2.15 39.63,1.14 48.64,1.14 49.78,2.29 49.78,2.36
COL2: length 111.4
  Top Layer w0.152: v1(50.55,8.89) 48.51,10.92 v1(48.51,25.91) v1(48.51,39.37) v1(48.51,58.17) 48.51,78.49 52.07,82.04 v1(52.07,84.58)
  Bottom Layer w0.152: v1(48.51,25.91) 48.51,22.89 48.55,22.86 ; v1(48.51,58.17) 48.51,60.93 48.55,60.96 ; 48.55,41.91 48.51,41.88 v1(48.51,39.37) ; v1(50.55,8.89) 50.55,7.62 51.05,7.11 R112.2 ; v1(52.07,84.58) 52.07,93.09 52.96,93.98 58.67,93.98 59.69,95 59.69,97.17
COL2_R: length 15
  Bottom Layer w0.152: 51.05,2.36 49.46,0.76 39.48,0.76 38.23,2.01 U101.4
CON_USB_N: length 132.1
  Top Layer w0.155: v1(49.02,100.84) 49.36,100.5 49.36,95.95 51.04,94.27 69.2,94.27 70.52,92.95 70.52,82.57 64.93,76.98 64.93,15.76 61.2,12.03 54.07,12.03 52.88,10.84 50.88,10.84 v1(50.55,11.18)
  Bottom Layer w0.155: v1(49.02,100.84) 49.36,101.17 49.36,102.27 D103.2 48.78,102.89 J101.5 48.78,106.31 49.02,106.55 49.53,106.55 49.78,106.3 J101.7 ; R109.1 v1(50.55,11.18)
CON_USB_P: length 131.9
  Top Layer w0.155: v1(50.04,100.84) 49.7,100.5 49.7,96.09 51.18,94.61 69.34,94.61 70.87,93.09 70.87,82.42 65.28,76.83 65.28,15.62 61.34,11.68 54.21,11.68 53.02,10.5 50.88,10.5 v1(50.55,10.16)
  Bottom Layer w0.155: J101.8 50.28,104.52 ; 50.28,104.52 50.28,102.89 D104.2 49.7,102.27 49.7,101.17 v1(50.04,100.84) ; 50.28,104.52 50.28,104.52 49.53,104.52 49.28,104.77 J101.6 ; R111.1 v1(50.55,10.16)
ENC1_A: length 119
  Top Layer w0.152: v1(9.65,89.41) 10.92,89.41 11.43,88.9 11.43,88.01 11.94,87.5 14.61,87.5 18.54,83.57 18.54,67.44 19.43,66.55 22.86,66.55 24.51,64.9 24.51,53.47 22.61,51.56 22.61,43.05 20.57,41.02 20.57,31.62 22.61,29.59 22.61,23.75 20.57,21.72 20.57,13.46 18.54,11.43 v1(18.54,8.89)
  Bottom Layer w0.152: 9.73,86.36 9.73,87.52 C203.2 9.65,87.67 v1(9.65,89.41) ; v1(18.54,8.89) 19.56,7.87 19.56,3.56 20.32,2.79 30.1,2.79 32.51,5.2 U101.18
ENC1_B: length 101.6
  Top Layer w0.152: v1(13.21,89.41) 14.35,89.41 19.3,84.45 19.3,67.82 19.81,67.31 23.24,67.31 25.4,65.15 25.4,53.21 23.5,51.31 23.5,42.93 21.34,40.77 21.34,32 23.37,29.97 23.37,23.5 21.34,21.46 21.34,17.78 v1(24.38,14.73)
  Bottom Layer w0.152: v1(24.38,14.73) 24.38,14.48 27.31,11.56 29.59,11.56 32.34,8.8 U101.27 ; v1(13.21,89.41) 13.21,87.67 C204.2 13.25,86.47 13.13,86.36
ENC1_SW: length 2
  Bottom Layer w0.152: D210.2 13.97,97.17
ENC2_A: length 91.2
  Top Layer w0.152: 34.93,89.28 34.04,88.39 32.51,88.39 28.83,84.71 28.83,62.48 27.56,61.21 27.56,22.61 26.67,21.72 26.67,16.89 27.43,16.13 v1(27.43,13.46)
  Bottom Layer w0.152: v1(27.43,13.46) 28.83,12.06 29.84,12.06 32.71,9.2 U101.28 ; v1(35.05,89.41) 35.05,87.67 C205.2 35.13,87.52 R206.1
ENC2_B: length 94
  Top Layer w0.152: v1(38.61,89.41) 38.61,88.39 37.85,87.63 33.02,87.63 29.72,84.33 29.72,61.98 28.45,60.71 28.45,22.48 27.56,21.59 27.56,17.15 28.45,16.26 v1(28.45,13.46)
  Bottom Layer w0.152: U101.29 32.52,10.15 29.65,13.02 28.89,13.02 v1(28.45,13.46) ; v1(38.61,89.41) 38.61,87.67 C206.2 38.65,86.47 R208.1
ENC2_SW: length 2
  Bottom Layer w0.152: D211.2 39.37,97.17
ENC3_A: length 107.5
  Top Layer w0.152: v1(33.02,11.18) 33.02,13.97 31.75,15.24 31.75,17.53 30.1,19.18 30.1,20.96 30.73,21.59 30.73,24 32.38,25.65 34.93,25.65 40.39,31.12 40.39,40.51 42.8,42.93 42.8,48.39 40.39,50.8 40.39,59.69 43.05,62.36 43.05,83.06 47.24,87.25 58.29,87.25 v1(60.45,89.41)
  Bottom Layer w0.152: v1(60.45,89.41) 60.45,87.67 C208.2 60.53,87.52 R211.1 ; v1(33.02,11.18) 34.29,11.18 34.63,10.84 U101.30
ENC3_B: length 113.7
  Top Layer w0.152: v1(32,11.94) 32,13.72 30.99,14.73 30.99,16.89 29.34,18.54 29.34,21.34 29.97,21.97 29.97,24.38 32,26.42 34.54,26.42 39.62,31.5 39.62,41.02 41.91,43.31 41.91,48.01 39.62,50.29 39.62,60.07 42.04,62.48 42.04,83.44 46.61,88.01 57.78,88.01 59.94,90.17 63.25,90.17 v1(64.01,89.41)
  Bottom Layer w0.152: U101.31 35.03,10.97 34.45,11.56 33.66,11.56 33.27,11.94 v1(32,11.94) ; v1(64.01,89.41) 64.01,87.67 C209.2 64.04,86.47 R212.1
ENC3_SW: length 2
  Bottom Layer w0.152: D212.2 64.77,97.17
LED0_BUF: length 57.8
  Top Layer w0.152: v1(29.72,15.88) 29.72,16.76 28.45,18.03 28.45,21.46 29.21,22.22 29.21,25.02 29.72,25.53 v1(29.72,50.29)
  Bottom Layer w0.152: R117.2 v1(29.72,15.88) ; U103.1 U103.2 10.41,50.8 10.92,50.29 v1(29.72,50.29)
LED0_DIN: length 6.5
  Bottom Layer w0.152: U103.4 9.46,53.27 9.91,52.83 12.7,52.83 12.95,52.58 14.97,52.58 LED201.4
LED0_RES: length 9.3
  Bottom Layer w0.152: U101.36 37.03,10.85 35.18,12.7 34.29,12.7 33.27,13.72 30.05,13.72 29.72,14.04
LED1_DIN: length 15.6
  Bottom Layer w0.152: LED201.2 20.58,54.87 21.08,55.37 29.72,55.37 32.5,52.59 LED202.4
LED2_DIN: length 15.6
  Bottom Layer w0.152: LED203.4 51.55,52.59 48.77,55.37 40.13,55.37 39.63,54.87 LED202.2
LED3_DIN: length 87
  Top Layer w0.152: v1(62.74,55.37) v1(62.74,49.02)
  Bottom Layer w0.152: v1(62.74,49.02) 28.07,49.02 27.56,49.53 13.08,49.53 8.25,44.7 8.25,40.26 7.11,39.12 7.11,34.54 8.12,33.54 LED204.4 ; LED203.2 58.68,54.87 59.18,55.37 v1(62.74,55.37)
LED4_DIN: length 15.6
  Bottom Layer w0.152: LED205.4 32.5,33.54 29.72,36.32 21.08,36.32 20.58,35.82 LED204.2
LED5_DIN: length 15.6
  Bottom Layer w0.152: LED205.2 39.63,35.82 40.13,36.32 48.77,36.32 51.55,33.54 LED206.4
LED6_DIN: length 83.7
  Top Layer w0.152: v1(62.74,36.32) v1(62.74,29.97)
  Bottom Layer w0.152: v1(62.74,29.97) 25.27,29.97 24.51,29.21 9.53,29.21 8.13,27.81 8.13,20.19 13.83,14.49 LED207.4 ; v1(62.74,36.32) 59.31,36.32 58.68,35.69 LED206.2
LED7_DIN: length 15.6
  Bottom Layer w0.152: LED207.2 20.58,16.77 21.08,17.27 29.72,17.27 32.5,14.49 LED208.4
LED8_DIN: length 17.3
  Bottom Layer w0.152: LED209.4 51.3,14.49 47.24,18.54 40.26,18.54 39.63,17.91 LED208.2
QSPI_SCLK: length 20.2
  Top Layer w0.152: v1(42.93,4.83) 44.32,3.43 52.2,3.43 52.71,3.94 v1(52.71,4.83)
  Bottom Layer w0.152: v1(42.93,4.83) 42.15,5.6 U101.52 ; v1(52.71,4.83) 52.71,5.72 53.59,6.6 53.59,7.62 53.97,8 U104.6
QSPI_SD0: length 16.9
  Top Layer w0.152: v1(52.71,7.49) 48.9,7.49 47.37,5.97 46.54,5.97 44.89,4.32 v1(44.7,4.32)
  Bottom Layer w0.152: U104.5 v1(52.71,7.49) ; U101.53 41.56,5.2 42.7,4.06 44.45,4.06 v1(44.7,4.32)
QSPI_SD1: length 19.3
  Top Layer w0.152: v1(46.74,4.32) 47.37,4.95 47.75,4.95 49.02,6.22 53.85,6.22 54.48,5.59 v1(55.25,5.59)
  Bottom Layer w0.152: U101.55 41.22,4.4 42.32,3.3 45.72,3.3 v1(46.74,4.32) ; U104.2 v1(55.25,5.59)
QSPI_SD2: length 20.1
  Top Layer w0.152: v1(45.72,4.32) 46.86,5.46 47.62,5.46 49.02,6.86 v1(54.61,6.86)
  Bottom Layer w0.152: U101.54 41.42,4.8 42.54,3.68 45.09,3.68 v1(45.72,4.32) ; v1(54.61,6.86) 54.61,6.22 53.97,5.59 U104.3
QSPI_SD3: length 18.7
  Top Layer w0.152: v1(43.94,4.83) 44.02,4.9 44.78,4.9 46.35,6.48 47.24,6.48 48.77,8 51.69,8 51.94,8.25 v1(55.25,8.25)
  Bottom Layer w0.152: U104.7 v1(55.25,8.25) ; v1(43.94,4.83) 42.76,6 U101.51
QSPI_SS: length 28.5
  Top Layer w0.152: v1(47.75,4.32) 49.15,4.32 50.42,5.59 53.47,5.59 54.23,4.83 v1(56.51,4.83)
  Bottom Layer w0.152: U101.56 41.08,4 42.16,2.92 46.35,2.92 v1(47.75,4.32) ; R124.2 61.09,2.23 61.09,4.19 60.71,4.57 58.04,4.57 57.66,4.19 57.66,3.43 57.3,3.07 U104.1 v1(56.51,4.83)
RESET_N: length 15.3
  Bottom Layer w0.152: R125.2 21.08,11.18 22.39,12.48 25.24,12.48 26.8,10.92 29.46,10.92 31.98,8.4 U101.26
ROW0: length 118
  Top Layer w0.152: v1(12.19,5.84) 12.83,6.48 12.83,14.48 8.51,18.8 8.51,24.76 10.16,26.42 10.16,28.83 9.02,29.97 9.02,45.97 10.92,47.88 v1(10.92,65.02)
  Bottom Layer w0.152: v1(12.19,5.84) 12.12,5.77 R113.2 ; D203.1 59.28,66.55 47.6,66.55 D202.1 43.84,66.55 29.31,66.55 27.43,64.67 D201.1 24.79,66.55 12.45,66.55 v1(10.92,65.02)
ROW0_R: length 29.5
  Bottom Layer w0.152: R113.1 C117.2 11.56,2.96 11.56,1.4 12.19,0.76 34.16,0.76 35.43,2.03 U101.11
ROW1: length 100.9
  Top Layer w0.152: v1(14.22,5.84) 13.59,6.48 13.59,14.73 9.4,18.92 9.4,24.38 10.92,25.91 10.92,29.59 10.03,30.48 10.03,44.58 v1(11.43,45.97)
  Bottom Layer w0.152: R114.2 14.15,5.77 v1(14.22,5.84) ; v1(11.43,45.97) 12.45,46.99 25.3,46.99 D204.1 30.38,45.62 31.5,46.74 44.61,46.74 D205.1 46.83,46.74 63.66,46.74 D206.1
ROW1_R: length 26.2
  Bottom Layer w0.152: R114.1 C120.2 13.84,2.96 13.84,1.65 14.35,1.14 34,1.14 35.03,2.17 U101.12
ROW2: length 80.5
  Top Layer w0.152: v1(12.95,27.43) 12.95,26.67 10.29,24 10.29,19.18 14.35,15.11 14.35,8 v1(16.51,5.84)
  Bottom Layer w0.152: v1(16.51,5.84) 16.44,5.77 R115.2 ; D209.1 63.4,27.94 49.15,27.94 47.78,26.57 D208.1 44.61,27.69 30.1,27.69 28.99,26.57 D207.1 25.81,27.43 v1(12.95,27.43)
ROW2_R: length 22.9
  Bottom Layer w0.152: U101.13 34.63,2.31 33.85,1.52 16.64,1.52 16.13,2.03 16.13,2.96 C121.2 R115.1
ROW3: length 178.6
  Top Layer w0.152: v1(13.97,91.44) 9.78,91.44 8.89,90.55 8.89,87.76 10.01,86.64 13.95,86.64 17.53,83.06 17.53,62.86 20.96,59.44 20.96,50.93 15.37,45.34 12.32,45.34 10.92,43.94 10.92,31.24 13.84,28.32 13.84,26.29 11.18,23.62 11.18,19.43 15.11,15.49 15.11,9.53 v1(18.8,5.84)
  Bottom Layer w0.152: v1(13.97,91.44) D210.1 D211.1 43.72,92.81 44.58,91.95 44.58,84.33 45.34,83.57 53.59,83.57 54.23,84.2 54.23,91.69 55.34,92.81 D212.1 ; v1(18.8,5.84) 18.72,5.77 R116.2
ROW3_R: length 19.6
  Bottom Layer w0.152: U101.14 34.23,2.45 33.69,1.91 18.92,1.91 18.41,2.41 18.41,2.93 17.78,3.56 C122.2 R116.1
SWCLK: length 89.8
  Top Layer w0.152: v1(24.64,48.01) 24.64,16.13 25.4,15.37 25.4,12.19 27.43,10.16 v1(27.94,10.16)
  Bottom Layer w0.152: v1(24.64,48.01) 25.65,48.01 26.16,47.5 66.55,47.5 J102.1 ; v1(27.94,10.16) 28.96,9.14 29.84,9.14 31.38,7.6 U101.24
SWDIO: length 89.3
  Top Layer w0.152: v1(25.65,48.77) 25.65,16.76 26.54,15.88 26.54,12.32 27.69,11.18 28.45,11.18 28.96,10.67 v1(28.96,10.16)
  Bottom Layer w0.152: J102.3 64.77,48.26 27.18,48.26 26.67,48.77 v1(25.65,48.77) ; U101.25 31.62,8 30.1,9.53 29.59,9.53 v1(28.96,10.16)
USB_N: length 9.8
  Bottom Layer w0.155: U101.46 41.09,8 41.11,7.98 42.01,7.98 42.93,8.89 44.96,8.89 46.91,10.84 48.07,10.84 48.41,11.18 R109.2
USB_P: length 9.8
  Bottom Layer w0.155: U101.47 41.09,7.6 41.11,7.63 42.16,7.63 43.07,8.54 45.1,8.54 47.05,10.5 48.07,10.5 48.41,10.16 R111.2
USER_LED1: length 122.6
  Top Layer w0.152: v1(51.05,85.34) 51.05,82.68 47.37,78.99 47.37,32.51 44.58,29.72 44.58,27.18 46.1,25.65 46.1,15.88 v1(45.21,14.99)
  Bottom Layer w0.152: v1(45.21,14.99) 44.58,14.99 44.32,15.24 42.04,15.24 39.37,12.57 37.81,12.57 37.43,12.19 U101.37 ; v1(51.05,85.34) 51.05,92.84 42.54,101.35 32.38,101.35 27.63,96.59 R103.2
USER_LED2_B: length 124.5
  Top Layer w0.152: v1(43.94,14.48) 43.94,15.24 45.34,16.64 45.34,25.02 43.81,26.54 43.81,30.35 46.23,32.77 46.23,79.63 50.04,83.44 v1(50.04,84.58)
  Bottom Layer w0.152: v1(50.04,84.58) 46.23,84.58 45.72,85.09 45.72,93.47 40.64,98.55 33.4,98.55 28.83,93.98 23.37,93.98 21.84,95.5 R107.2 ; v1(43.94,14.48) 41.91,14.48 40.13,12.7 40.13,11.68 39.5,11.05 38.86,11.05 38.63,10.82 U101.40
USER_LED2_G: length 120.5
  Top Layer w0.152: v1(39.37,11.94) 44.45,17.02 44.45,24.51 43.05,25.91 43.05,30.99 45.21,33.15 45.21,80.26 49.02,84.07 v1(49.02,85.34)
  Bottom Layer w0.152: v1(49.02,85.34) 47.62,85.34 46.86,86.11 46.86,93.85 41.28,99.44 33.15,99.44 28.57,94.87 23.88,94.87 23.11,95.63 R106.2 ; v1(39.37,11.94) 38.86,11.43 38.48,11.43 38.23,11.18 U101.39
USER_LED2_R: length 118.5
  Top Layer w0.152: v1(38.1,11.94) 43.56,17.4 43.56,23.88 42.04,25.4 42.04,31.5 44.2,33.66 44.2,80.9 48.01,84.71 v1(48.01,86.36)
  Bottom Layer w0.152: v1(38.1,11.94) 37.83,11.67 U101.38 ; v1(48.01,86.36) 48.01,94.36 42.04,100.33 32.77,100.33 28.07,95.63 24.76,95.63 24.38,96.01 R105.2
X_R: length 3.5
  Bottom Layer w0.152: Y101.3 24.34,8.85 C124.1 26.24,8.78 R121.1
XIN: length 13.1
  Bottom Layer w0.152: Y101.1 22.52,5.55 23.2,4.86 C123.1 27.14,4.86 27.61,4.39 R120.2 29.82,4.39 31.44,6 U101.20
XOUT: length 8.3
  Bottom Layer w0.152: 27.1,7.37 27.1,6.04 27.89,5.26 R120.1 30.02,5.26 31.17,6.4 U101.21
$1N6734: length 5.1
  Bottom Layer w0.152: R118.2 53.09,102.23 51.28,104.04 J101.10
$1N6739: length 5.3
  Bottom Layer w0.152: R119.2 45.97,102.23 48.28,104.54 J101.4
$1N8227: length 12.1
  Bottom Layer w0.152: 59.62,1.52 59.69,1.52 60.45,0.76 62.36,0.76 62.66,1.07 62.66,2.94 SW101.4 SW101.3
$1N8669: length 10.8
  Bottom Layer w0.152: 19.38,11.18 19.38,9.91 17.65,9.91 17.27,10.29 SW102.4 SW102.3
$1N9158: length 7.7
  Top Layer w0.152: v1(26.67,98.55) 26.67,102.23 25.82,103.09 LED103.1
  Bottom Layer w0.152: R103.1 v1(26.67,98.55)
$1N9334: length 3.1
  Top Layer w0.152: LED102.1 v1(29.97,103.09)
  Bottom Layer w0.152: R104.1 29.79,102.94 29.97,103.12
$1N13120: length 12.6
  Top Layer w0.152: LED101.2 16.89,102.36 17.65,101.6 23.11,101.6 24.38,100.33 v1(24.38,98.55)
  Bottom Layer w0.152: R105.1 v1(24.38,98.55)
$1N13125: length 12.1
  Top Layer w0.152: v1(23.11,98.55) 23.11,99.69 22.1,100.71 17.14,100.71 16.12,101.73 LED101.3
  Bottom Layer w0.152: R106.1 v1(23.11,98.55)
$1N13131: length 14.2
  Top Layer w0.152: v1(21.84,98.55) 21.84,99.31 21.34,99.82 16,99.82 14.73,101.09 14.73,104.01 15.24,104.52 16.12,104.52 LED101.4
  Bottom Layer w0.152: R107.1 v1(21.84,98.55)
$2N527: length 3.3
  Bottom Layer w0.152: 23.9,63.5 25.5,63.5 D201.2
$2N632: length 3.3
  Bottom Layer w0.152: 42.95,63.5 44.55,63.5 D202.2
$2N737: length 4.3
  Bottom Layer w0.152: 62,63.5 62.64,64.15 D203.2
$2N1048: length 3.3
  Bottom Layer w0.152: 23.9,44.45 25.5,44.45 D204.2
$2N1050: length 3.3
  Bottom Layer w0.152: 42.95,44.45 44.55,44.45 D205.2
$2N1052: length 3.3
  Bottom Layer w0.152: 62,44.45 63.6,44.45 D206.2
$2N1363: length 3.3
  Bottom Layer w0.152: D207.2 25.5,25.4 23.9,25.4
$2N1365: length 3.3
  Bottom Layer w0.152: 42.95,25.4 44.55,25.4 D208.2
$2N1367: length 3.3
  Bottom Layer w0.152: 62,25.4 63.6,25.4 D209.2
$2N1909: length 4.4
  Bottom Layer w0.152: R205.2 R201.1 10.59,84.37 8.89,82.67
$2N1913: length 4.4
  Bottom Layer w0.152: R207.2 R202.1 12.27,84.37 13.97,82.67
$2N2803: length 4.4
  Bottom Layer w0.152: 34.29,82.67 35.99,84.37 R203.1 R206.2
$2N2807: length 4.4
  Bottom Layer w0.152: 39.37,82.67 37.67,84.37 R204.1 R208.2
$2N3267: length 4.4
  Bottom Layer w0.152: R211.2 R209.1 61.39,84.37 59.69,82.67
$2N3271: length 4.4
  Bottom Layer w0.152: 64.77,82.67 63.07,84.37 R210.1 R212.2

## Copper pours and planes (outline as drawn; the poured copper is in the pictures)
+3V3 on Top Layer: 5.21,52.96 5.21,50.67 7.49,50.67 7.49,52.96
+3V3 on Top Layer: 20.07,9.53 25.05,9.53 28.17,6.4 33.58,6.4 35.05,7.87 35.05,9.53 40.26,9.53 40.89,10.16 44.2,10.16 44.2,7.49 42.15,5.44 42.15,2.65 40.13,0.63 20.07,0.63
+3V3 on Bottom Layer: 5.21,52.96 7.49,52.96 7.49,43.43 5.84,43.43 5.84,50.04 5.21,50.67
+5V_LEDS on Bottom Layer: 63.5,39.62 71.37,39.62 71.37,31.5 63.5,31.5
+5V_USB on Top Layer: 1.02,58.8 8.89,58.8 8.89,53.59 1.02,53.59
+5V_USB on Top Layer: 38.23,104.9 56.64,104.9 57.91,106.17 61.47,106.17 61.47,101.85 38.23,101.85
+5V_USB on Bottom Layer: 44.45,104.9 44.45,102.62 38.23,102.62 38.23,104.9
+5V_USB on Bottom Layer: 1.02,55.75 4.44,55.75 4.44,53.59 1.02,53.59
+5V_USB on Bottom Layer: 61.47,103.63 61.47,106.17 57.91,106.17 57.91,104.9 54.61,104.9 54.61,103.25 57.66,103.25 57.66,103.63
GND on Bottom Layer: 2.67,52.2 4.44,52.2 4.44,47.88 4.95,47.37 4.95,42.16 6.22,42.16 6.22,33.4 1.02,33.4 1.02,42.16 3.68,42.16 3.68,46.36 3.43,46.61 2.67,46.61
GND on Inner1: 0.26,111.5 73.4,111.5 73.4,0.26 0.26,0.26
GND on Inner2: 0.26,111.5 73.4,111.5 73.4,0.26 0.26,0.26

Small or netless copper shapes (teardrops, artwork), in the pictures only: 86 on Inner1, 86 on Inner2

## Text on the board
Bottom Silkscreen Layer: MYKEYBOARD V1.0 | (C)2025 FEDEVEL | RESET | BOOT | www.fedevel.com | LEARN HOW TO DESIGN BOARDS | FEDEVEL ONLINE COURSES
Document Layer: Custom Keyboard © 2025 by FEDEVEL / is licensed under Creative Commons / Attribution-NonCommercial-ShareAlike 4.0 International / https://creativecommons.org/licenses/by-nc-sa/4.0/
Top Silkscreen Layer: RGB | USER | POWER
